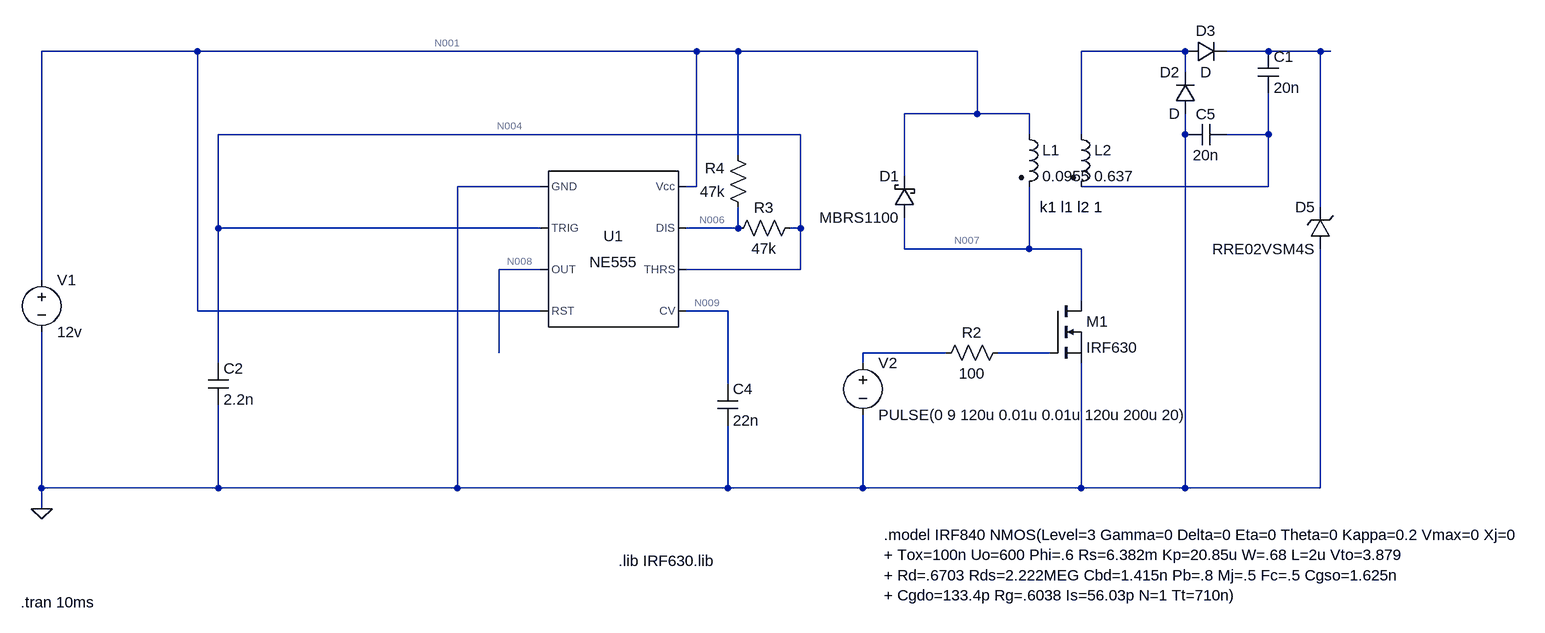
[diagram p0: schematic Geiger.asc]
Geiger.asc, the LTspice schematic file:
Version 4
SHEET 1 2004 680
WIRE -400 -192 -640 -192
WIRE 368 -192 -400 -192
WIRE 432 -192 368 -192
WIRE 800 -192 432 -192
WIRE 1120 -192 960 -192
WIRE 1248 -192 1184 -192
WIRE 1328 -192 1248 -192
WIRE 1344 -192 1328 -192
WIRE 1120 -160 1120 -192
WIRE 800 -96 800 -192
WIRE 800 -96 688 -96
WIRE 880 -96 800 -96
WIRE 528 -64 -368 -64
WIRE 880 -64 880 -96
WIRE 960 -64 960 -192
WIRE 1120 -64 1120 -96
WIRE 1248 -64 1248 -128
WIRE 1248 -64 1184 -64
WIRE 432 -32 432 -192
WIRE 688 0 688 -96
WIRE 128 16 0 16
WIRE 368 16 368 -192
WIRE 368 16 352 16
WIRE 1248 16 1248 -64
WIRE 1248 16 960 16
WIRE 1328 48 1328 -192
WIRE -368 80 -368 -64
WIRE 128 80 -368 80
WIRE 432 80 432 48
WIRE 432 80 352 80
WIRE 528 80 528 -64
WIRE 528 80 512 80
WIRE 688 112 688 64
WIRE 880 112 880 16
WIRE 880 112 688 112
WIRE 960 112 880 112
WIRE 128 144 64 144
WIRE 528 144 528 80
WIRE 528 144 352 144
WIRE -640 160 -640 -192
WIRE 960 192 960 112
WIRE -400 208 -400 -192
WIRE 128 208 -400 208
WIRE 416 208 352 208
WIRE 64 272 64 144
WIRE 752 272 624 272
WIRE 912 272 832 272
WIRE -368 288 -368 80
WIRE 624 288 624 272
WIRE 416 320 416 208
WIRE -640 480 -640 240
WIRE -368 480 -368 352
WIRE -368 480 -640 480
WIRE 0 480 0 16
WIRE 0 480 -368 480
WIRE 416 480 416 384
WIRE 416 480 0 480
WIRE 624 480 624 368
WIRE 624 480 416 480
WIRE 960 480 960 288
WIRE 960 480 624 480
WIRE 1120 480 1120 -64
WIRE 1120 480 960 480
WIRE 1328 480 1328 112
WIRE 1328 480 1120 480
WIRE -640 512 -640 480
FLAG -640 512 0
SYMBOL NE555 240 112 R0
SYMATTR InstName U1
SYMBOL cap -384 288 R0
SYMATTR InstName C2
SYMATTR Value 2.2n
SYMBOL voltage -640 144 R0
WINDOW 123 0 0 Left 0
WINDOW 39 0 0 Left 0
SYMATTR InstName V1
SYMATTR Value 12v
SYMBOL res 848 256 R90
WINDOW 0 0 56 VBottom 2
WINDOW 3 32 56 VTop 2
SYMATTR InstName R2
SYMATTR Value 100
SYMBOL nmos 912 192 R0
SYMATTR InstName M1
SYMATTR Value IRF630
SYMBOL ind2 864 -80 R0
SYMATTR InstName L1
SYMATTR Value 0.0955
SYMATTR Type ind
SYMATTR SpiceLine Rser=1m Rpar=0
SYMBOL ind2 944 -80 R0
SYMATTR InstName L2
SYMATTR Value 0.637
SYMATTR Type ind
SYMATTR SpiceLine Rser=1m Rpar=0
SYMBOL res 528 64 R90
WINDOW 0 0 56 VBottom 2
WINDOW 3 32 56 VTop 2
SYMATTR InstName R3
SYMATTR Value 47k
SYMBOL res 448 64 R180
WINDOW 0 36 76 Left 2
WINDOW 3 36 40 Left 2
SYMATTR InstName R4
SYMATTR Value 47k
SYMBOL cap 400 320 R0
SYMATTR InstName C4
SYMATTR Value 22n
SYMBOL diode 1136 -96 R180
WINDOW 0 24 64 Left 2
WINDOW 3 24 0 Left 2
SYMATTR InstName D2
SYMBOL diode 1120 -176 R270
WINDOW 0 32 32 VTop 2
WINDOW 3 0 32 VBottom 2
SYMATTR InstName D3
SYMBOL cap 1232 -192 R0
SYMATTR InstName C1
SYMATTR Value 20n
SYMBOL cap 1184 -80 R90
WINDOW 0 0 32 VBottom 2
WINDOW 3 32 32 VTop 2
SYMATTR InstName C5
SYMATTR Value 20n
SYMBOL zener 1344 112 R180
WINDOW 0 24 64 Left 2
WINDOW 3 24 0 Left 2
SYMATTR InstName D5
SYMATTR Value RRE02VSM4S
SYMBOL schottky 704 64 R180
WINDOW 0 24 64 Left 2
WINDOW 3 24 0 Left 2
SYMATTR InstName D1
SYMATTR Value MBRS1100
SYMATTR Description Diode
SYMATTR Type diode
SYMBOL voltage 624 272 R0
WINDOW 123 0 0 Left 0
WINDOW 39 0 0 Left 0
SYMATTR InstName V2
SYMATTR Value PULSE(0 9 120u 0.01u 0.01u 120u 200u 20)
TEXT 656 552 Left 2 !.model IRF840 NMOS(Level=3 Gamma=0 Delta=0 Eta=0 Theta=0 Kappa=0.2 Vmax=0 Xj=0\n+ Tox=100n Uo=600 Phi=.6 Rs=6.382m Kp=20.85u W=.68 L=2u Vto=3.879\n+ Rd=.6703 Rds=2.222MEG Cbd=1.415n Pb=.8 Mj=.5 Fc=.5 Cgso=1.625n\n+ Cgdo=133.4p Rg=.6038 Is=56.03p N=1 Tt=710n)
TEXT 896 48 Left 2 !k1 l1 l2 1
TEXT -672 656 Left 2 !.tran 10ms
TEXT 248 592 Left 2 !.lib IRF630.lib

The netlist it stands for:
* Geiger.asc
XU1 0 N004 N008 N001 N009 N004 N006 N001 NE555  ; pins GND TRIG OUT RST CV THRS DIS Vcc
C2 N004 0 2.2n
V1 N001 0 12v
R2 N011 N010 100
M1 N007 N011 0 0 IRF630
L1 N001 N007 0.0955 Rser=1m Rpar=0
L2 N002 N005 0.637 Rser=1m Rpar=0
R3 N004 N006 47k
R4 N006 N001 47k
C4 N009 0 22n
D2 0 N002 D
D3 N002 N003 D
C1 N003 N005 20n
C5 N005 0 20n
D5 0 N003 RRE02VSM4S
D1 N007 N001 MBRS1100
V2 N010 0 PULSE(0 9 120u 0.01u 0.01u 120u 200u 20)
.model D D
.lib standard.dio
.model NMOS NMOS
.model PMOS PMOS
.lib standard.mos
.model IRF840 NMOS(Level=3 Gamma=0 Delta=0 Eta=0 Theta=0 Kappa=0.2 Vmax=0 Xj=0
+ Tox=100n Uo=600 Phi=.6 Rs=6.382m Kp=20.85u W=.68 L=2u Vto=3.879
+ Rd=.6703 Rds=2.222MEG Cbd=1.415n Pb=.8 Mj=.5 Fc=.5 Cgso=1.625n
+ Cgdo=133.4p Rg=.6038 Is=56.03p N=1 Tt=710n)
k1 l1 l2 1
.tran 10ms
.lib IRF630.lib
.lib NE555.sub
.backanno
.end

* Results of the author's LTspice run, read from the files saved beside the schematic
* Operating Point, zero values left out:
*   V(n004) = 12 V
*   V(n009) = 8 V
*   V(n001) = 12 V
*   V(n006) = 12 V
*   V(n008) = 12 V
*   V(n007) = 12 V
*   Id(M1) = 9.657 µA
*   Ib(M1) = -1.259 µA
*   Is(M1) = -8.397 µA
*   I(D1) = -3.373 pA
*   I(L1) = 9.657 µA
*   I(R4) = -40 nA
*   I(R3) = -23.99 nA
*   I(V1) = -3.891 mA
*   Ix(u1:1) = -3.881 mA
*   Ix(u1:2) = 12 nA
*   Ix(u1:4) = 69.33 µA
*   Ix(u1:6) = 12 nA
*   Ix(u1:7) = 16.01 nA
*   Ix(u1:8) = 3.812 mA